# EAGLE design greenhouse (EAGLE 9.4.1)
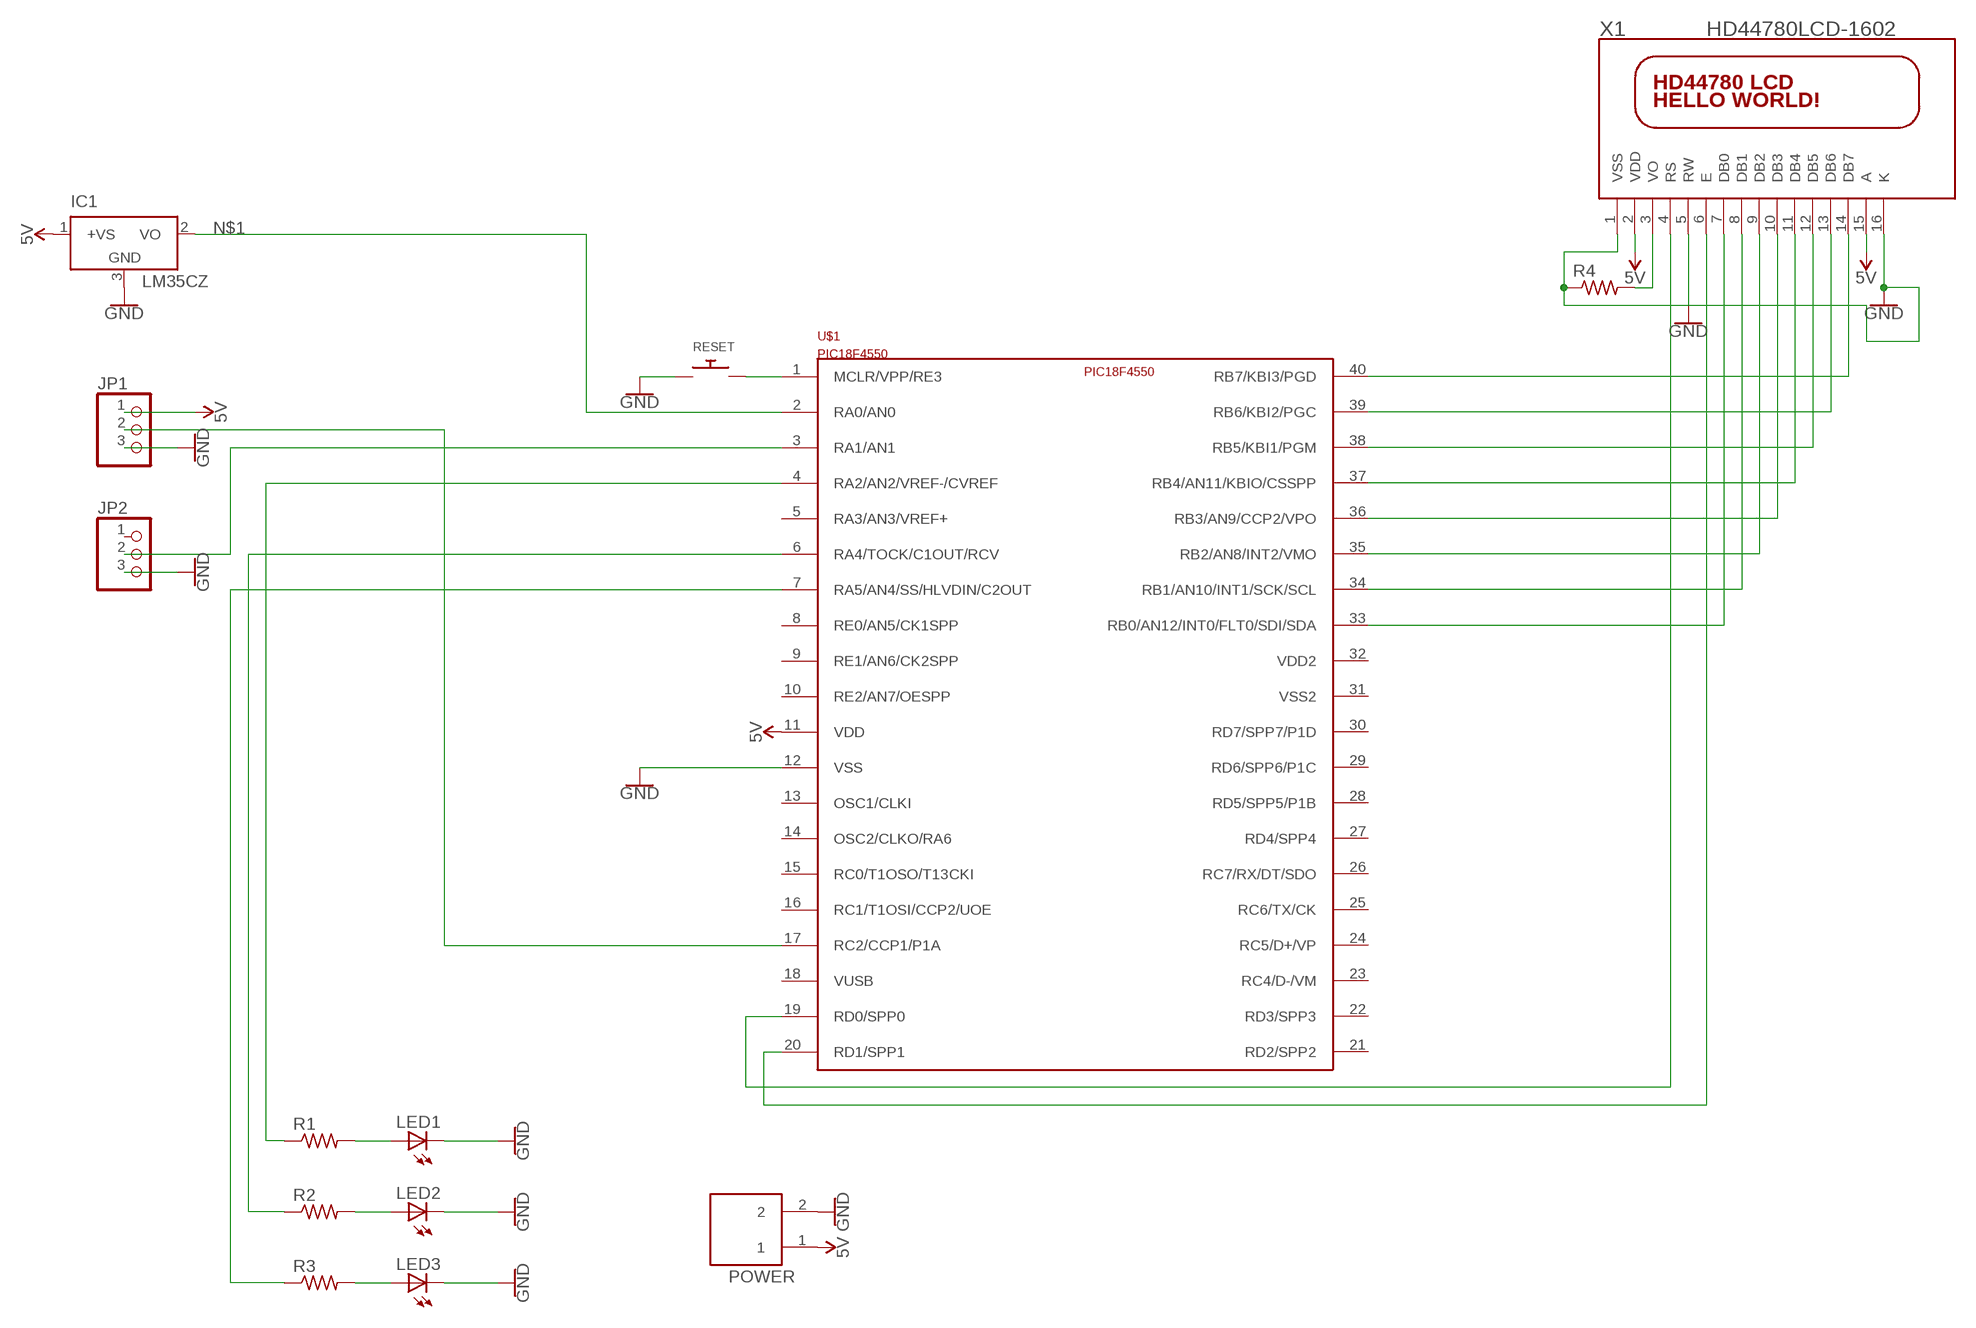
[diagram p0: schematic, sheet 1]

## Parts
IC1  LM35CZ  [TO92]
JP1  PINHD-1X3  [1X03]
JP2  PINHD-1X3  [1X03]
LED1  LED5MM  [LED5MM]
LED2  LED5MM  [LED5MM]
LED3  LED5MM  [LED5MM]
POWER  ED555/2DS  [ED555/2DS]
R1  R-US_0204/2V  [0204V]
R2  R-US_0204/2V  [0204V]
R3  R-US_0204/2V  [0204V]
R4  R-US_0204/2V  [0204V]
RESET  SWITCH_PUSHBUTTONEVQ-PE  [TACT_PANA-EVQ]
U$1  PIC18F4550  [PDIP-40]
X1  HD44780LCD-1602  [LCD1602]

## Nets
5V: IC1.1(+VS) JP1.1 POWER.1 U$1.11(VDD) X1.15(A)
GND: IC1.3(GND) JP1.3 JP2.3 LED1.K(C) LED2.K(C) LED3.K(C) POWER.2 R4.1 RESET.P$1 U$1.12(VSS) X1.1(VSS) X1.16(K)
N$1: IC1.2(VO) U$1.2(RA0/AN0)
N$2: JP1.2 U$1.17(RC2/CCP1/P1A)
N$3: JP2.2 U$1.3(RA1/AN1)
N$4: R4.2 X1.3(VO)
N$5: X1.5(RW) ; supply symbol labelled GND
N$6: U$1.40(RB7/KBI3/PGD) X1.14(DB7)
N$8: U$1.39(RB6/KBI2/PGC) X1.13(DB6)
N$9: U$1.20(RD1/SPP1) X1.6(E)
N$10: U$1.19(RD0/SPP0) X1.4(RS)
N$18: U$1.38(RB5/KBI1/PGM) X1.12(DB5)
N$19: U$1.37(RB4/AN11/KBIO/CSSPP) X1.11(DB4)
N$20: LED1.A R1.2
N$21: LED2.A R2.2
N$22: LED3.A R3.2
N$23: R1.1 U$1.4(RA2/AN2/VREF-/CVREF)
N$24: R2.1 U$1.6(RA4/TOCK/C1OUT/RCV)
N$25: R3.1 U$1.7(RA5/AN4/SS/HLVDIN/C2OUT)
N$26: RESET.P$2 U$1.1(MCLR/VPP/RE3)
N$27: U$1.36(RB3/AN9/CCP2/VPO) X1.10(DB3)
N$28: U$1.35(RB2/AN8/INT2/VMO) X1.9(DB2)
N$29: U$1.34(RB1/AN10/INT1/SCK/SCL) X1.8(DB1)
N$30: U$1.33(RB0/AN12/INT0/FLT0/SDI/SDA) X1.7(DB0)
VDD: X1.2(VDD) ; supply symbol labelled 5V
Unconnected: JP2.1 U$1.5(RA3/AN3/VREF+) U$1.8(RE0/AN5/CK1SPP) U$1.9(RE1/AN6/CK2SPP) U$1.10(RE2/AN7/OESPP) U$1.13(OSC1/CLKI) U$1.14(OSC2/CLKO/RA6) U$1.15(RC0/T1OSO/T13CKI) U$1.16(RC1/T1OSI/CCP2/UOE) U$1.18(VUSB) U$1.21(RD2/SPP2) U$1.22(RD3/SPP3) U$1.23(RC4/D-/VM) U$1.24(RC5/D+/VP) U$1.25(RC6/TX/CK) U$1.26(RC7/RX/DT/SDO) U$1.27(RD4/SPP4) U$1.28(RD5/SPP5/P1B) U$1.29(RD6/SPP6/P1C) U$1.30(RD7/SPP7/P1D)

## Power pins joined to a net without a drawn wire
VDD2: U$1.32(VDD2)
VSS2: U$1.31(VSS2)

## Library data of the parts
IC1 = lm35:LM35: Single-Supply Centigrade Temperature Sensor Vout = (10mV/°C x Temp °C) +5mmmV Source: http://www.national.com/ds/LM/LM35.pdf
JP1 JP2 = adafruit:PINHD-1X3: PIN HEADER
LED1-LED3 = adafruit:LED: LED OSRAM: - CHIPLED LG R971, LG N971, LY N971, LG Q971, LY Q971, LO R971, LY R971 LH N974, LH R974 LS Q976, LO Q976, LY Q976 LO Q996 - Hyper CHIPLED LW Q18S LB Q993, LB Q99A, LB R99A - SideLED LS A670, LO A670, LY A670, LG A670, LP A670 LB A673, LV A673, LT A673, LW A673 LH A674 LY A675 LS A676, LA A676, LO A676, LY A676, LW A676 LS A679, LY A679, LG A679 - Hyper Micro SIDELED® LS Y876, LA Y876, LO Y876, LY Y876 LT Y87S - SmartLED LW L88C, LW L88S LB L89C, LB L89S, LG L890 LS L89K, LO L89K, LY L89K LS L896, LA L896, LO L896, LY L896 - TOPLED LS T670, LO T670, LY T670, LG T670, LP T670 LSG T670, LSP T670, LSY T670, LOP T670, LYG T670 LG T671, LOG T671, LSG T671 LB T673, LV T673, LT T673, LW T673 LH T674 LS T676, LA T676, LO T676, LY T676, LB T676, LH T676, LSB T676, LW T676 LB T67C, LV T67C, LT T67C, LS T67K, LO T67K, LY T67K, LW E67C LS E67B, LA E67B, LO E67B, LY E67B, LB E67C, LV E67C, LT E67C LW T67C LS T679, LY T679, LG T679 LS T770, LO T770, LY T770, LG T770, LP T770 LB T773, LV T773, LT T773, LW T773 LH T774 LS E675, LA E675, LY E675, LS T675 LS T776, LA T776, LO T776, LY T776, LB T776 LHGB T686 LT T68C, LB T68C - Hyper Mini TOPLED® LB M676 - Mini TOPLED Santana® LG M470 LS M47K, LO M47K, LY M47K Source: http://www.osram.convergy.de/
POWER = DC_LOAD_AU:ED555/2DS: 2-Pin Terminal Block 3.5mm pitch 6A
R1-R4 = adafruit:R-US_: RESISTOR, American symbol
RESET = adafruit:SWITCH_PUSHBUTTON: Buttons SOFTTOUCHSMD_SJ - Soft touch temporary push button (Super Junk Akihabara) Compatible with SKPMANE010 [Mouser: 688-SKPMAN] C&K_KSS = Digikey: KSS221GLFS
U$1 = pic18f4550:PIC18F4550
X1 = adafruit:HD44780LCD: HD44780 LCD Standard character type LCDs, available in sizes from 8x1 to 40x4!

## Net classes
0 default: width 0.254 mm, drill 0.089 mm, clearance 0.076 mm

## Board
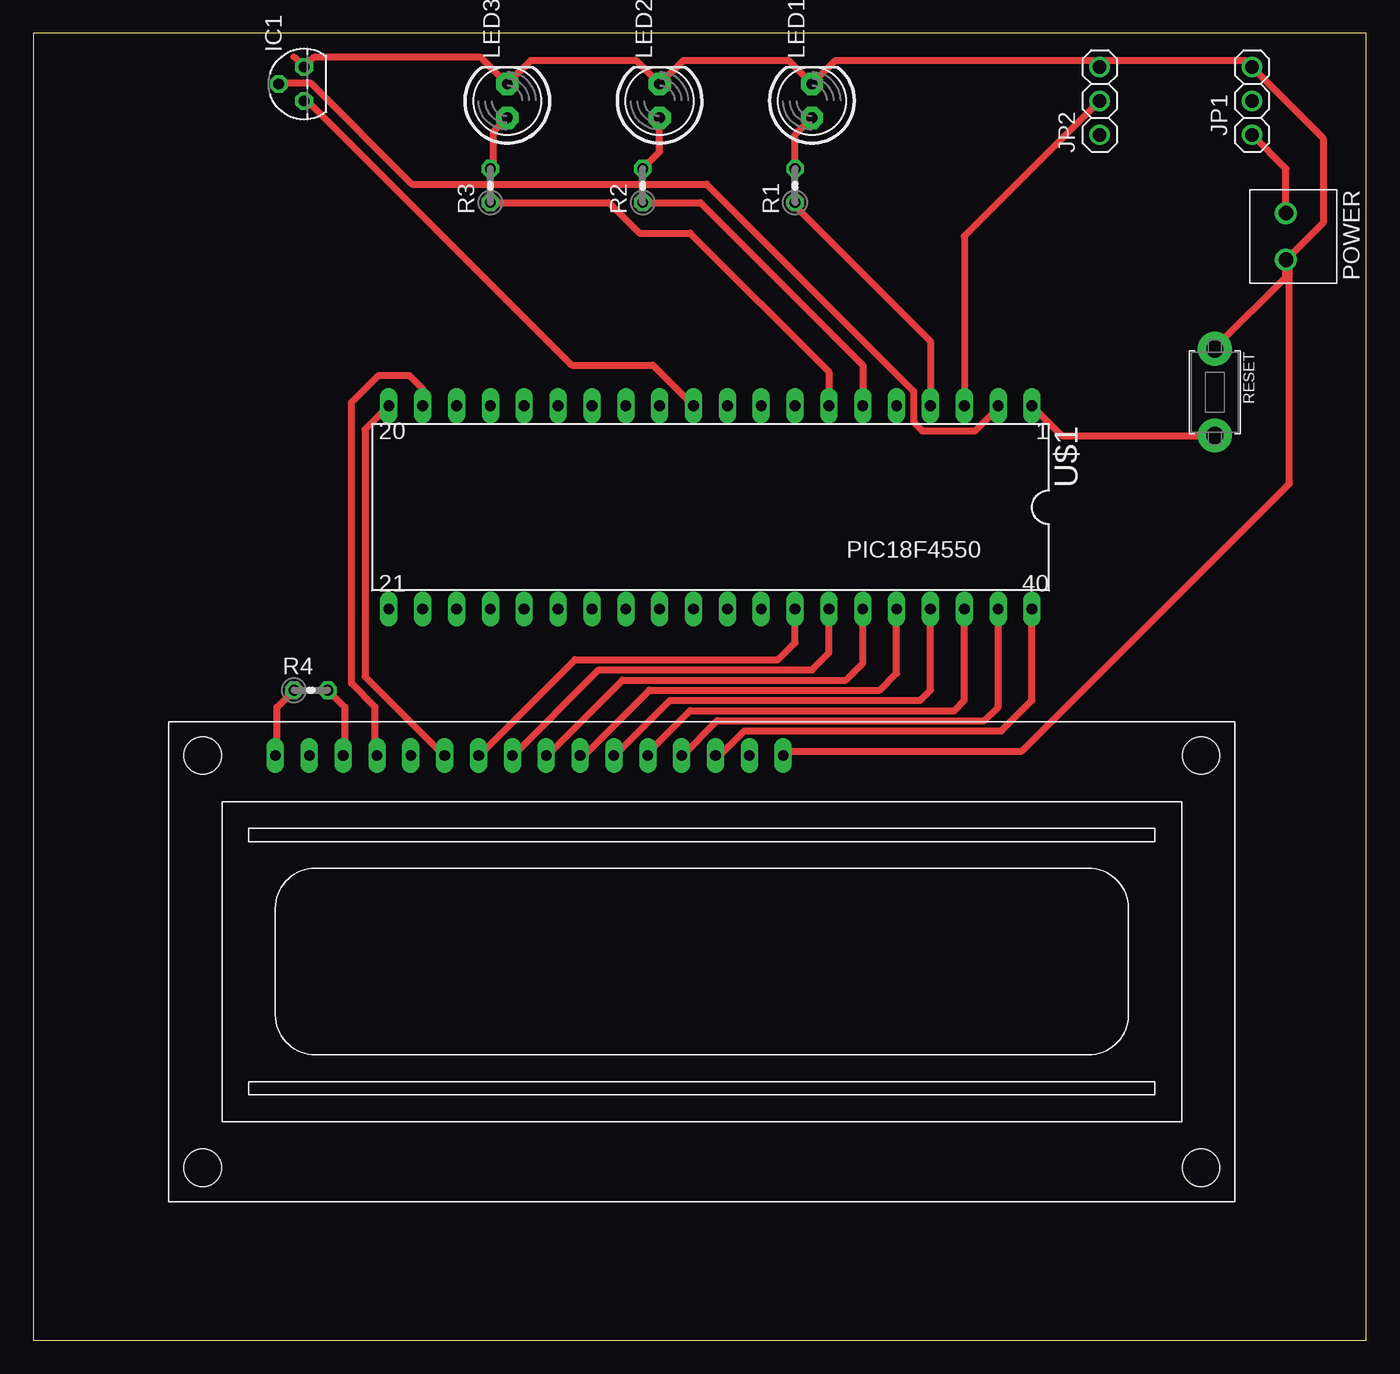
[diagram p1: board, top side]
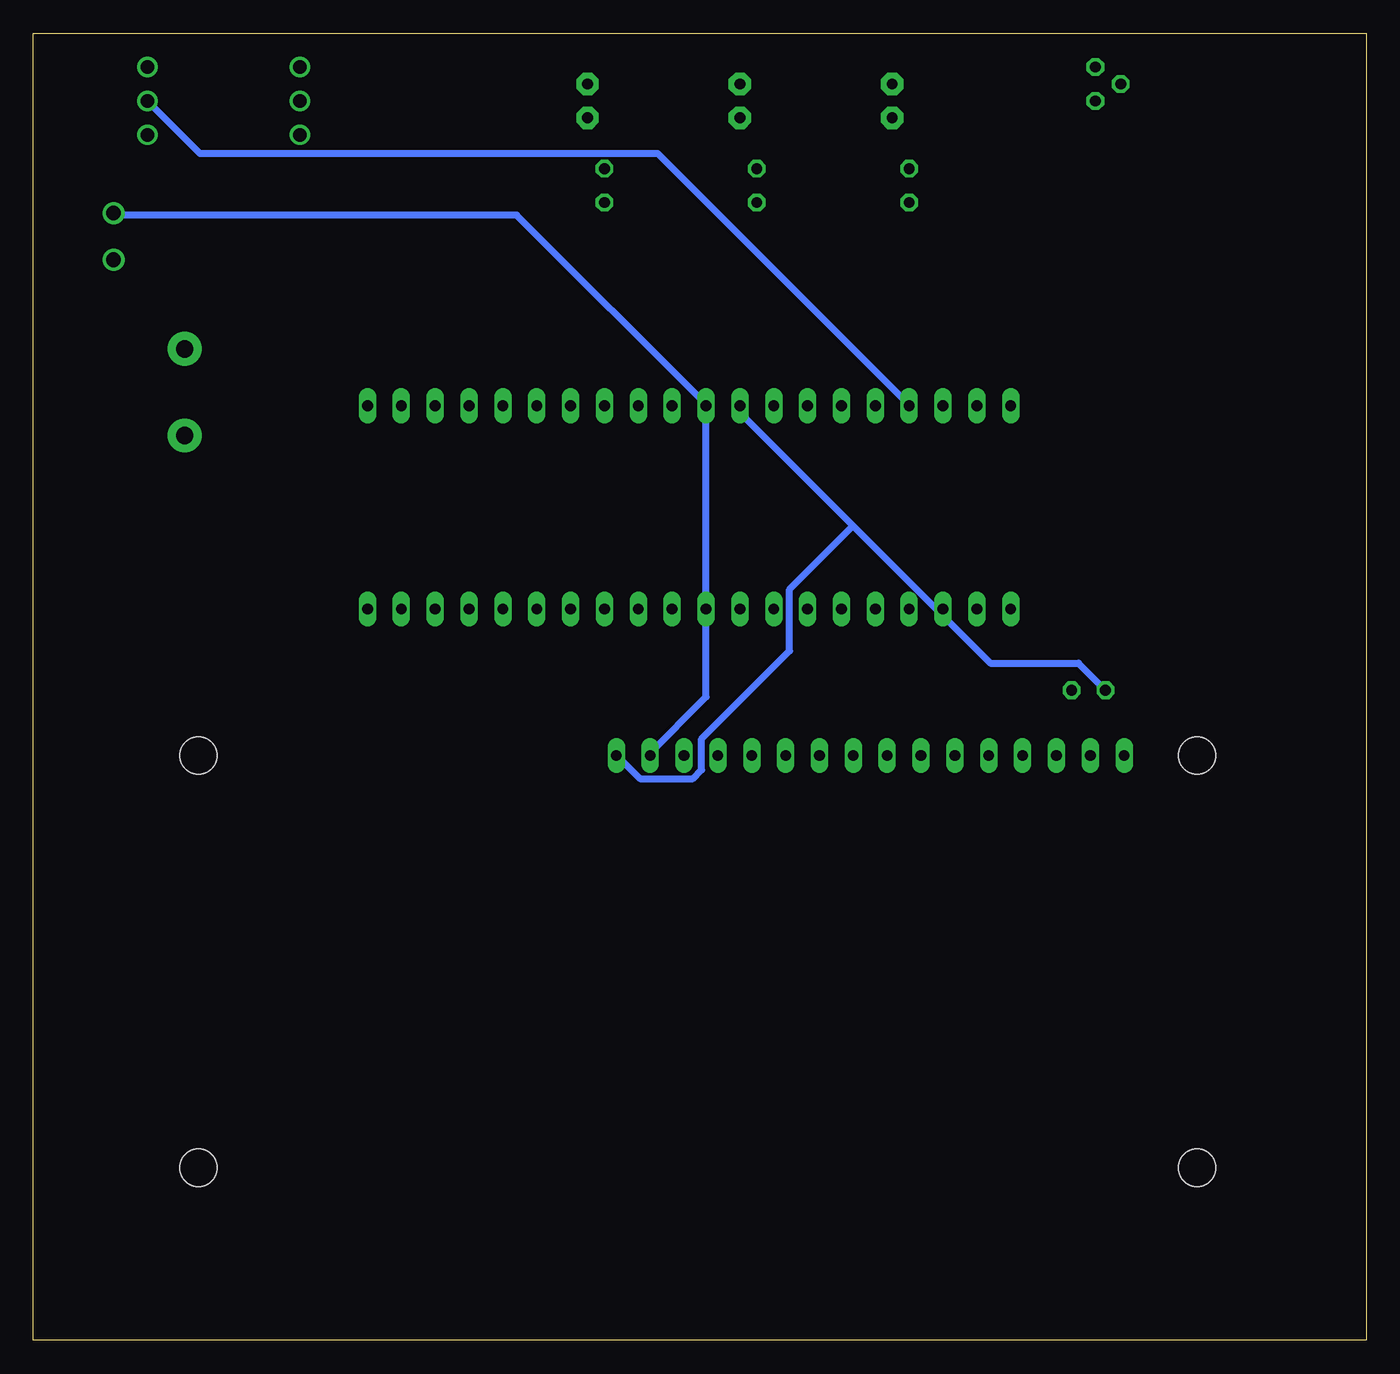
[diagram p2: board, bottom side, seen from below]

Size 100 x 98.03 mm. Coordinates in mm from the lower left corner, seen from the top.
Outline: 0,0 100,0 100,98.03 0,98.03 0,0
Copper layers (1*16): Top 0.035mm / dielectric 1.5mm / Bottom 0.035mm
Design rules "default *": minimum track width 20mil, minimum drill 0.35mm, track to track 6mil, track to pad 6mil, pad to pad 6mil, via to via 6mil, smd to smd 6mil, copper to edge 40mil, drill to drill 6mil, minimum pad ring 10mil, minimum via ring 8mil, stop-mask expansion 4mil, vias tented up to drill 0mil, thermal gap 10mil

### Footprints (pad centres in the part's own frame; a part is rotated, then mirrored left to right if it is on the bottom)
TO92 = drill 0.813 octagon: 1 -1.27,0; 2 0,1.905; 3 1.27,0
1X03 = drill 1.016: 1 -2.54,0; 2 0,0; 3 2.54,0
LED5MM = drill 0.813 pad 1.676 octagon: A -1.27,0; K 1.27,0
ED555/2DS = drill 1.1: 1 -1.75,0; 2 1.75,0
0204V = drill 0.813 octagon: 1 -1.27,0; 2 1.27,0
TACT_PANA-EVQ = drill 1.3 pad 2.54: P$1 -3.25,0; P$2 3.25,0
PDIP-40 = drill 0.813 long: 1 -19.05,-8.89; 2 -16.51,-8.89; 3 -13.97,-8.89; 4 -11.43,-8.89; 5 -8.89,-8.89; 6 -6.35,-8.89; 7 -3.81,-8.89; 8 -1.27,-8.89; 9 1.27,-8.89; 10 3.81,-8.89; 11 6.35,-8.89; 12 8.89,-8.89; 13 11.43,-8.89; 14 13.97,-8.89; 15 16.51,-8.89; 16 19.05,-8.89; 17 21.59,-8.89; 18 24.13,-8.89; 19 26.67,-8.89; 20 29.21,-8.89; 21 29.21,6.35; 22 26.67,6.35; 23 24.13,6.35; 24 21.59,6.35; 25 19.05,6.35; 26 16.51,6.35; 27 13.97,6.35; 28 11.43,6.35; 29 8.89,6.35; 30 6.35,6.35; 31 3.81,6.35; 32 1.27,6.35; 33 -1.27,6.35; 34 -3.81,6.35; 35 -6.35,6.35; 36 -8.89,6.35; 37 -11.43,6.35; 38 -13.97,6.35; 39 -16.51,6.35; 40 -19.05,6.35
LCD1602 = drill 0.8 long: 1 8,33.46; 2 10.54,33.46; 3 13.08,33.46; 4 15.62,33.46; 5 18.16,33.46; 6 20.7,33.46; 7 23.24,33.46; 8 25.78,33.46; 9 28.32,33.46; 10 30.86,33.46; 11 33.4,33.46; 12 35.94,33.46; 13 38.48,33.46; 14 41.02,33.46; 15 43.56,33.46; 16 46.1,33.46 | hole 2.8: 2.54,2.54; 2.54,33.46; 77.46,33.46; 77.46,2.54

### Placement (x,y rotation side)
IC1  20.32,94.23 90 top
JP1  91.44,92.96 90 top
JP2  80.01,92.96 90 top
LED1  58.42,92.96 90 top
LED2  46.99,92.96 90 top
LED3  35.56,92.96 90 top
POWER  93.98,82.8 270 top
R1  57.15,86.61 90 top
R2  45.72,86.61 90 top
R3  34.29,86.61 90 top
R4  20.83,48.77 0 top
RESET  88.65,71.12 270 top
U$1  55.88,61.21 180 top
X1  10.16,10.41 0 top

### Tracks (layer width: path | path; a pad name or v marks a point on that pad's centre or on a via)
5V
  Top 0.508: 93.98,84.58 93.98,84.73 | 93.98,84.73 93.98,87.88 JP1.1 | 20.32,93.22 20.51,93.03 | 20.51,93.03 40.39,73.15 46.48,73.15 U$1.11 | POWER.1 94.11,84.73 93.98,84.73 | 20.51,93.03 20.47,92.99 IC1.1
  Bottom 0.508: X1.15 53.82,43.79 53.85,43.94 49.53,48.26 U$1.11 49.53,70.21 63.73,84.4 93.78,84.4 POWER.1
GND
  Top 0.508: 19.56,96.27 IC1.3 21.08,96.27 33.53,96.27 LED3.K 37.34,96.01 45.21,96.01 LED2.K 48.77,96.01 56.64,96.01 LED1.K 60.2,96.01 79.5,96.01 JP2.3 80.52,96.01 90.93,96.01 JP1.3 96.77,90.17 96.77,83.82 93.98,81.03 93.98,80.26 | 94.23,80.01 94.23,64.26 74.17,44.2 56.64,44.2 56.46,44.12 X1.16 | 94.23,80.01 94.23,80.52 94.04,80.71 | 94.04,80.71 93.98,80.77 | 94.23,80.01 93.98,80.26 | R4.1 18.29,47.5 18.29,43.94 18.16,43.79 X1.1 | 88.65,74.42 88.77,74.55 | 88.77,74.55 93.98,79.76 93.98,80.26 | 94.04,80.71 94.11,80.77 POWER.2 | RESET.P$1 88.82,74.5 88.77,74.55
  Bottom 0.508: 38.49,61.1 47.24,69.85 U$1.12 | 38.49,61.1 28.19,50.8 21.59,50.8 R4.1 | 38.49,61.1 43.26,56.34 43.26,51.71 49.86,45.11 49.86,42.8 50.52,42.14 54.48,42.14 56.13,43.79 X1.16
N$1
  Top 0.508: U$1.2 72.31,69.88 70.66,68.22 66.7,68.22 66.04,68.88 66.04,71.2 50.52,86.72 28.4,86.72 20.8,94.31 18.49,94.31 IC1.2
N$2
  Bottom 0.508: JP1.2 87.5,89.03 53.16,89.03 34.34,70.21 U$1.17
N$3
  Top 0.508: JP2.2 69.85,82.8 U$1.3
N$4
  Top 0.508: R4.2 23.37,47.5 23.37,43.79 | 23.37,43.79 23.37,43.69 | X1.3 23.44,43.79 23.37,43.79
N$6
  Top 0.508: U$1.40 74.93,48.01 72.64,45.72 53.34,45.72 51.56,43.94 51.51,43.79 51.18,43.79 X1.14
N$8
  Top 0.508: U$1.39 72.39,47.5 71.37,46.48 51.31,46.48 48.77,43.94 48.87,43.79 X1.13
N$9
  Top 0.508: U$1.20 24.89,68.33 24.89,49.78 30.96,43.71 | 30.96,43.71 30.99,43.69 | X1.6 31.04,43.79 30.96,43.71
N$10
  Top 0.508: U$1.19 29.21,71.37 28.19,72.39 25.91,72.39 23.88,70.36 23.88,49.28 25.65,47.5 25.65,44.45 25.76,44.45 25.76,44.12 X1.4
N$18
  Top 0.508: U$1.38 69.85,48.01 69.09,47.24 49.28,47.24 45.97,43.94 45.9,43.79 X1.12
N$19
  Top 0.508: U$1.37 67.31,48.77 66.55,48.01 47.75,48.01 43.69,43.94 43.59,43.79 X1.11
N$20
  Top 0.508: 57.15,87.63 R1.2 | R1.2 57.15,88.04 | 57.15,88.04 57.15,90.42 LED1.A | R1.2 57.12,88.04 57.15,88.04
N$21
  Top 0.508: R2.2 46.99,89.15 LED2.A
N$22
  Top 0.508: 34.54,87.88 34.54,88.04 | 34.54,88.04 34.54,90.68 LED3.A | R3.2 34.34,88.04 34.54,88.04
N$23
  Top 0.508: 57.15,85.09 57.31,84.93 | 57.31,84.93 67.31,74.93 U$1.4 | R1.1 57.45,85.06 57.31,84.93
N$24
  Top 0.508: R2.1 50.04,85.34 62.23,73.15 U$1.6
N$25
  Top 0.508: R3.1 43.18,85.34 45.47,83.06 49.28,83.06 59.69,72.64 59.69,70.21 | 59.69,70.21 U$1.7 | U$1.7 59.69,69.85 | U$1.7 59.77,70.21 59.69,70.21
N$26
  Top 0.508: U$1.1 77.22,67.82 88.65,67.82 88.82,67.89 RESET.P$2
N$27
  Top 0.508: U$1.36 64.77,50.04 63.5,48.77 46.23,48.77 41.4,43.94 41.27,43.79 X1.10
N$28
  Top 0.508: U$1.35 62.23,50.8 60.96,49.53 44.2,49.53 38.61,43.94 38.63,43.79 X1.9
N$29
  Top 0.508: 35.81,43.69 35.95,43.83 | 35.95,43.83 42.42,50.29 58.42,50.29 59.69,51.56 U$1.34 | X1.8 35.99,43.79 35.95,43.83
N$30
  Top 0.508: U$1.33 57.15,52.32 55.88,51.05 40.64,51.05 33.53,43.94 33.68,43.79 X1.7